# EAGLE design TinyCube14_FourLayerABC_HorizHeaderrRouted (EAGLE 7.5.0)

## Sheet 1 of 2
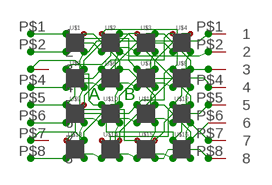
[diagram p0: schematic, sheet 1]

### Parts
U$1  PILLAR  [10MIL]
U$2  PILLAR  [10MIL]
U$3  PILLAR  [10MIL]
U$4  PILLAR  [10MIL]
U$5  PILLAR  [10MIL]
U$6  PILLAR  [10MIL]
U$7  PILLAR  [10MIL]
U$8  PILLAR  [10MIL]
U$9  PILLAR  [10MIL]
U$10  PILLAR  [10MIL]
U$11  PILLAR  [10MIL]
U$12  PILLAR  [10MIL]
U$13  PILLAR  [10MIL]
U$14  PILLAR  [10MIL]
U$15  PILLAR  [10MIL]
U$16  PILLAR  [10MIL]
U$51  TINY_HEADER_DEV  [TINY_HEADER_PKG]
U$52  TINY_HEADER_DEV  [TINY_HEADER_PKG]

### Nets
N$1: U$1.R(B) U$7.R(B) U$12.R(B) U$14.R(B) U$51.P$1
N$7: U$1.+(G) U$6.+(G) U$11.+(G) U$16.+(G) U$52.P$6
N$8: U$2.R(B) U$8.R(B) U$11.R(B) U$13.R(B) U$52.P$4
N$9: U$1.G(A) U$2.G(A) U$3.G(A) U$4.G(A) U$51.P$2
N$10: U$5.G(A) U$6.G(A) U$7.G(A) U$8.G(A) U$51.P$4
N$11: U$9.G(A) U$10.G(A) U$11.G(A) U$12.G(A) U$51.P$6
N$12: U$13.G(A) U$14.G(A) U$15.G(A) U$16.G(A) U$51.P$8
N$13: U$1.B(R) U$5.B(R) U$9.B(R) U$13.B(R) U$52.P$1
N$14: U$4.R(B) U$6.R(B) U$9.R(B) U$15.R(B) U$51.P$5
N$15: U$3.B(R) U$7.B(R) U$11.B(R) U$15.B(R) U$52.P$8
N$16: U$4.B(R) U$8.B(R) U$12.B(R) U$16.B(R) U$52.P$7
N$17: U$2.B(R) U$6.B(R) U$10.B(R) U$14.B(R) U$52.P$2
N$18: U$2.+(G) U$5.+(G) U$12.+(G) U$15.+(G) U$51.P$3
N$19: U$3.+(G) U$8.+(G) U$9.+(G) U$14.+(G) U$52.P$3
N$21: U$4.+(G) U$7.+(G) U$10.+(G) U$13.+(G) U$51.P$7
N$22: U$3.R(B) U$5.R(B) U$10.R(B) U$16.R(B) U$52.P$5

### Notes on the sheet
- A | B

## Sheet 2 of 2

## Library data of the parts
U$1-U$16 = PILLAR:PILLAR
U$51 U$52 = TinyHeader:TINY_HEADER_DEV

## Board
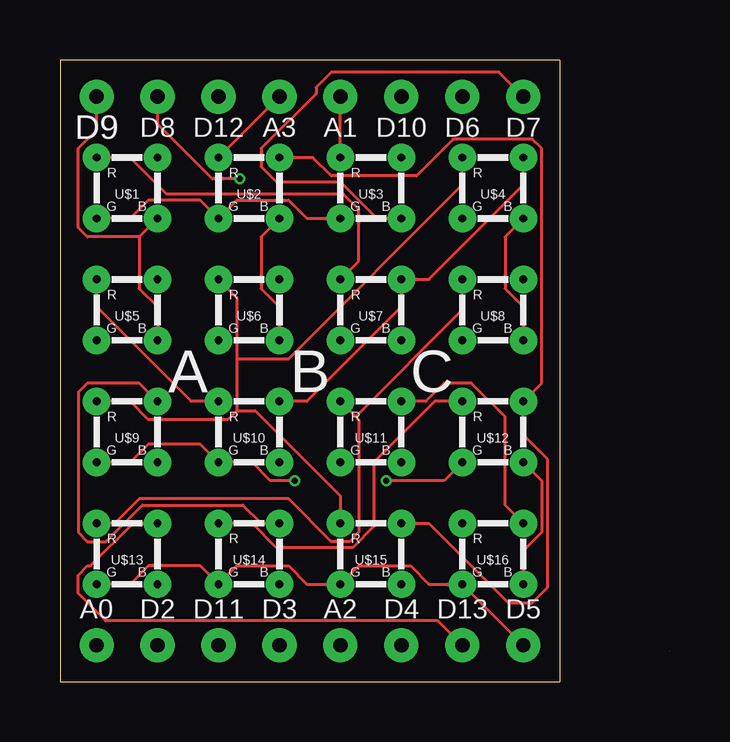
[diagram p1: board, top side]
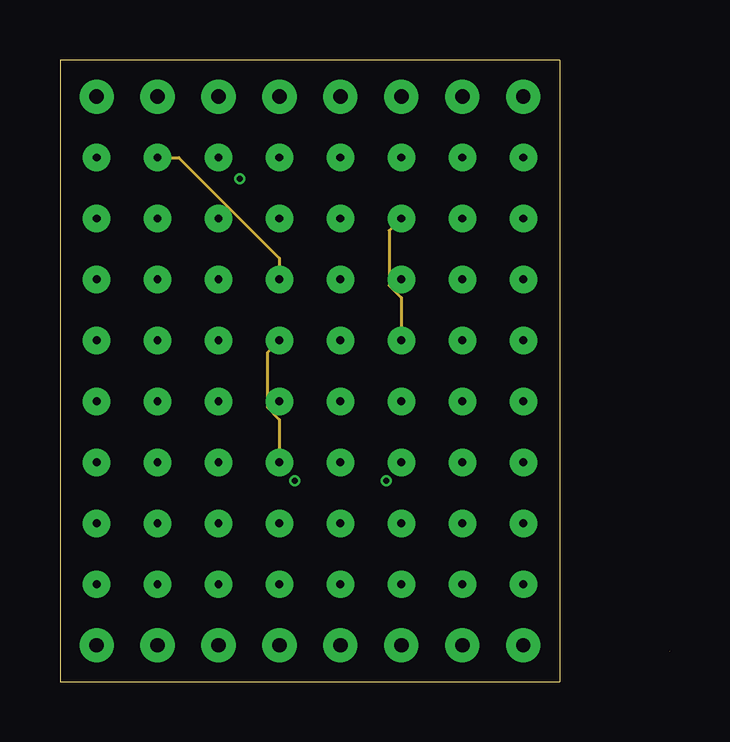
[diagram p2: board, inner layer Route15]
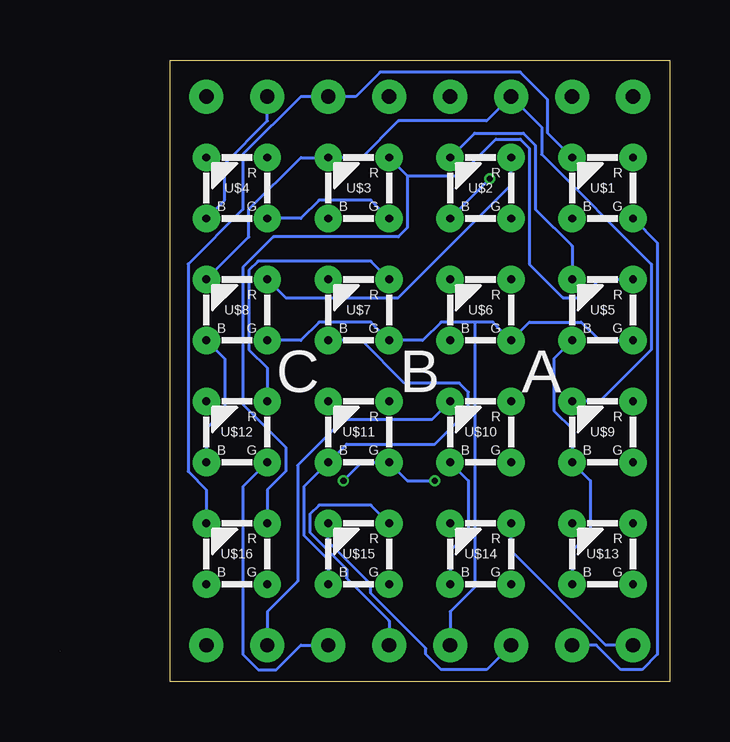
[diagram p3: board, bottom side, seen from below]

Size 25.4 x 25.91 mm. Coordinates in mm from the lower left corner, seen from the top.
Outline: 25.4,1.27 25.4,1.27
Outline: 20.83,25.91 20.83,0 0,0 0,25.91 20.83,25.91
Copper layers ((1*2)+(15*16)): Top 0.035559375mm / dielectric 0.17018125mm / Route2 0.01778125mm / dielectric 47mil / Route15 0.01778125mm / dielectric 0.17018125mm / Bottom 0.035559375mm
Design rules "OSHPark-4layer *": minimum track width 5mil, minimum drill 10mil, track to track 5mil, track to pad 5mil, pad to pad 5mil, via to via 5mil, smd to smd 5mil, copper to edge 15mil, drill to drill 6mil, minimum pad ring 4mil, minimum via ring 4mil, stop-mask expansion 2.5mil, vias tented up to drill 0mil, thermal gap 10mil

### Footprints (pad centres in the part's own frame; a part is rotated, then mirrored left to right if it is on the bottom)
10MIL = drill 0.33 pad 1.143: + 1.27,1.27; B 1.27,-1.27; G -1.27,-1.27; R -1.27,1.27
TINY_HEADER_PKG = drill 0.6 pad 1.422: P$1 0,0; P$2 0,-2.54; P$3 0,-5.08; P$4 0,-7.62; P$5 0,-10.16; P$6 0,-12.7; P$7 0,-15.24; P$8 0,-17.78

### Placement (x,y rotation side)
U$1  2.79,20.57 0 top
U$2  7.87,20.57 0 top
U$3  12.95,20.57 0 top
U$4  18.03,20.57 0 top
U$5  2.79,15.49 0 top
U$6  7.87,15.49 0 top
U$7  12.95,15.49 0 top
U$8  18.03,15.49 0 top
U$9  2.79,10.41 0 top
U$10  7.87,10.41 0 top
U$11  12.95,10.41 0 top
U$12  18.03,10.41 0 top
U$13  2.79,5.33 0 top
U$14  7.87,5.33 0 top
U$15  12.95,5.33 0 top
U$16  18.03,5.33 0 top
U$51  1.52,1.52 90 top
U$52  1.52,24.38 90 top

### Tracks (layer width: path | path; a pad name or v marks a point on that pad's centre or on a via)
N$1
  Top 0.127: U$1.R 2.92,21.84 4.45,20.32 11.81,20.32 12.45,19.69 12.45,17.53 U$7.R | U$14.R 8,6.6 9.02,5.59 12.19,5.59 13.08,6.48 13.08,9.14 15.62,11.68 U$12.R
  Bottom 0.127: U$14.R 6.6,5.46 2.67,1.52 U$51.P$1 | U$12.R 16.76,13.08 17.53,13.84 17.53,17.14 17.15,17.53 12.45,17.53 U$7.R
N$7
  Top 0.127: U$11.+ 15.24,11.68 16,12.45 17.15,12.45 18.54,11.05 18.54,7.37 U$16.+
  Route15 0.127: U$6.+ 9.14,17.65 4.95,21.84 U$1.+
  Bottom 0.127: U$1.+ 5.08,22.86 5.08,24.26 6.22,25.4 12.06,25.4 13.08,24.38 U$52.P$6 15.37,24.38 17.78,21.97 17.78,19.69 20.07,17.4 20.07,8.76 19.3,8 U$16.+
N$8
  Top 0.127: U$52.P$4 U$2.R | U$13.R 2.29,6.6 3.3,7.62 9.53,7.62 11.3,5.84 12.06,5.84 12.45,6.22 12.45,10.92 12.32,11.05 | U$11.R 12.32,11.05 | U$8.R 16.76,15.49 12.32,11.05
  Bottom 0.127: U$2.R 6.6,20.7 11.3,16 16,16 U$8.R
N$9
  Top 0.127: U$1.G 2.92,19.3 3.68,20.07 5.84,20.07 U$2.G 7.37,20.07 9.53,20.07 10.29,19.3 U$3.G
  Bottom 0.127: U$4.G 15.37,19.3 14.61,20.07 12.45,20.07 U$3.G | U$51.P$2 3.05,1.52 2.03,0.51 1.14,0.51 0.51,1.14 0.51,18.29 U$1.G
N$10
  Bottom 0.127: U$5.G 2.92,14.22 3.68,14.99 5.84,14.99 U$6.G 7.37,14.99 8.13,14.99 | 8.13,14.99 9.53,14.99 10.29,14.22 U$7.G 12.45,14.99 14.61,14.99 15.37,14.22 U$8.G | U$51.P$4 9.14,2.92 8.13,3.94 8.13,14.99
N$11  (via drill 0.25)
  Top 0.127: U$9.G 2.92,9.14 3.68,9.91 5.84,9.91 U$10.G 8,9.14 8.76,8.38 v9.78,8.38 | v13.59,8.38 16,8.38 U$12.G
  Bottom 0.127: v13.59,8.38 12.83,9.14 U$11.G 10.92,8.38 v9.78,8.38 | U$51.P$6 15.37,1.52 16.38,0.51 17.15,0.51 17.78,1.14 17.78,8.13 U$12.G
N$12
  Top 0.127: U$51.P$8 U$16.G 15.37,4.06 14.61,4.83 12.45,4.83 U$15.G 10.29,4.06 9.53,4.83 7.37,4.83 U$14.G 5.84,4.83 3.68,4.83 2.92,4.06 U$13.G
N$13
  Top 0.127: U$5.B 4.06,15.62 3.3,16.38 3.3,18.54 | U$1.B 3.3,18.54 | U$52.P$1 1.52,22.99 0.76,22.23 0.76,18.92 1.14,18.54 3.3,18.54
  Bottom 0.127: U$13.B 4.06,5.46 3.3,6.22 3.3,8.38 U$9.B 4.06,10.54 4.83,11.3 4.83,13.46 U$5.B
N$14
  Top 0.127: U$9.R 2.92,11.68 3.68,10.92 6.98,10.92 7.37,11.3 | 7.37,13.46 7.37,16 U$6.R | 7.37,13.46 7.37,11.3 | U$15.R 11.68,7.75 8.13,11.3 7.37,11.3 | U$4.R 16.76,20.7 9.53,13.46 7.37,13.46
  Bottom 0.127: U$51.P$5 11.68,2.54 13.46,4.32 13.46,4.7 14.99,6.22 14.99,6.98 14.61,7.37 12.45,7.37 U$15.R
N$15
  Top 0.127: U$3.B 13.21,19.3 11.68,20.83 9.02,20.83 8.38,21.46 8.38,22.23 10.67,24.51 10.67,24.77 11.3,25.4 18.29,25.4 U$52.P$8
  Route15 0.127: U$7.B 14.22,16 13.72,16.51 13.72,18.8 U$3.B
  Bottom 0.127: U$15.B 14.22,5.08 15.24,6.1 15.24,8.13 U$11.B 13.46,9.91 9.78,9.91 8.38,11.3 8.38,12.06 8.76,12.45 11.05,12.45 12.83,14.22 U$7.B
N$16
  Top 0.127: U$16.B 19.3,5.46 20.07,6.22 20.07,8.38 U$12.B | U$8.B 19.3,15.62 18.54,16.38 18.54,18.54 U$4.B
  Bottom 0.127: U$52.P$7 16.76,23.37 18.54,21.59 18.54,20.07 U$4.B | U$12.B 19.3,10.54 18.54,11.3 18.54,13.46 U$8.B
N$17  (via drill 0.25)
  Top 0.127: U$6.B 9.14,15.62 8.38,16.38 8.38,18.54 U$2.B | U$52.P$2 4.06,23.24 6.35,20.96 v7.49,20.96
  Route15 0.127: U$10.B 9.14,10.92 8.64,11.43 8.64,13.72 U$6.B
  Bottom 0.127: U$14.B 9.14,5.46 8.38,6.22 8.38,8.38 U$10.B | U$2.B v7.49,20.96
N$18
  Top 0.127: U$15.+ 15.37,6.6 18.67,3.3 19.69,3.3 20.32,3.94 20.32,9.27 19.3,10.29 U$12.+ 20.07,12.45 20.07,22.23 19.69,22.61 16.38,22.61 14.86,21.08 11.3,21.08 10.54,21.84 U$2.+
  Bottom 0.127: U$5.+ 4.06,18.16 5.59,19.69 5.59,22.35 6.1,22.86 8.13,22.86 U$2.+ | U$15.+ 14.22,5.84 12.45,4.06 12.45,3.68 10.16,1.4 10.16,1.14 9.53,0.51 7.62,0.51 U$51.P$3
N$19
  Top 0.127: U$14.+ 8.38,6.6 7.62,7.37 3.43,7.37 1.9,5.84 1.14,5.84 0.76,6.22 0.76,12.06 1.14,12.45 3.3,12.45 U$9.+
  Bottom 0.127: U$8.+ 17.53,18.54 17.53,19.69 15.37,21.84 U$3.+ 12.83,21.84 11.3,23.37 7.62,23.37 U$52.P$3 5.33,23.11 5.33,21.97 0.76,17.4 0.76,13.84 2.92,11.68 U$9.+
N$21
  Top 0.127: U$13.+ 3.05,6.6 1.27,4.83 1.14,4.83 0.76,4.45 0.76,3.68 1.9,2.54 15.75,2.54 U$51.P$7 | U$10.+ 10.29,11.68 14.22,15.62 U$7.+ 15.37,16.76 19.3,20.7 U$4.+
  Bottom 0.127: U$51.P$7 16.76,2.92 15.49,4.19 15.49,9.02 13.59,10.92 9.91,10.92 U$10.+
N$22
  Top 0.127: U$5.R 1.52,15.62 5.46,11.68 U$10.R | U$3.R U$52.P$5
  Bottom 0.127: U$16.R 16.76,8 16,8.76 16,9.78 17.78,11.56 17.78,17.27 16.51,18.54 11.3,18.54 10.92,18.92 10.92,21.08 | U$3.R 10.92,21.08 | U$5.R 2.92,16.76 3.68,16 4.45,16 5.84,17.4 5.84,22.23 6.22,22.61 7.24,22.61 8.76,21.08 10.92,21.08

### Text on the board
tPlace: A | B | C
bPlace: A | B | C
tNames: D9 | D8 | D12 | A3 | A1 | D10 | D6 | D7 | A0 | D2 | D11 | D3 | A2 | D4 | D13 | D5